# Altium schematic sheet DigitalIO.SchDoc
size A4; Author: Suraj; DrawnBy: Suraj; Engineer: Suraj; Organization: Simcons Control Systems; Address1: Kalamassery; Address2: Cochin; Address4: India
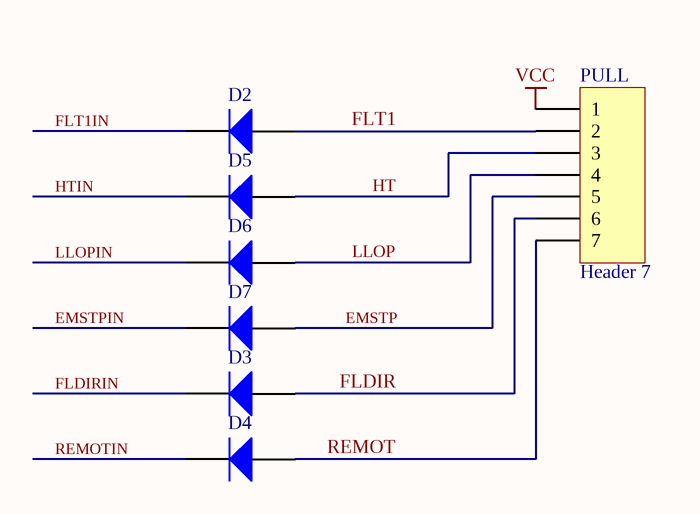
[diagram p0: DigitalIO.SchDoc]

## Parts
D2  Diode 1N4001  [4148SMD]  (value not drawn)
D3  Diode 1N4001  [4148SMD]  (value not drawn)
D4  Diode 1N4001  [4148SMD]  (value not drawn)
D5  Diode 1N4001  [4148SMD]  (value not drawn)
D6  Diode 1N4001  [4148SMD]  (value not drawn)
D7  Diode 1N4001  [4148SMD]  (value not drawn)
PULL  Header 7  [HDR1X7]

## Nets
VCC: PULL.1
EMSTP: D7.1(A) PULL.5
EMSTPIN: D7.2(K)
FLDIR: D3.1(A) PULL.6
FLDIRIN: D3.2(K)
FLT1: D2.1(A) PULL.2
FLT1IN: D2.2(K)
HT: D5.1(A) PULL.3
HTIN: D5.2(K)
LLOP: D6.1(A) PULL.4
LLOPIN: D6.2(K)
REMOT: D4.1(A) PULL.7
REMOTIN: D4.2(K)

## Notes on the sheet
- Title
- Size:
- A4
- Number:
- Revision:
- Simcons Control Systems
- Kalamassery
- Cochin
- India
- Date:
- Drawn By:
- SURAJ K A
- Sheet
- of

## Library data of the parts
D2-D7 = Diode 1N4001: 1 Amp General Purpose Rectifier; Published: 8-Jun-2000; LatestRevisionDate: 17-Jul-2002; LatestRevisionNote: Re-released for DXP Platform.; DatasheetVersion: 1998; PackageVersion: Aug-1999; PackageReference: DO-41; Publisher: Altium Limited; PackageDescription: Diode, Axial; Body 5.2 x 2.7 mm (LxDia. max), Lead Dia. 0.86 mm (max); Code_JEDEC: DO-204-AL; ComponentLink1Description: Manufacturer Link; ComponentLink1URL: http://www.fairchildsemi.com/; ComponentLink2Description: Datasheet; ComponentLink2URL: http://www.fairchildsemi.com/ds/1N%2F1N4001.pdf
PULL = Header 7: Header, 7-Pin; LatestRevisionDate: 17-Jul-2002; LatestRevisionNote: Re-released for DXP Platform.; Publisher: Altium Limited